# EAGLE design picoPromSD_1.1 (EAGLE 9.6.2)
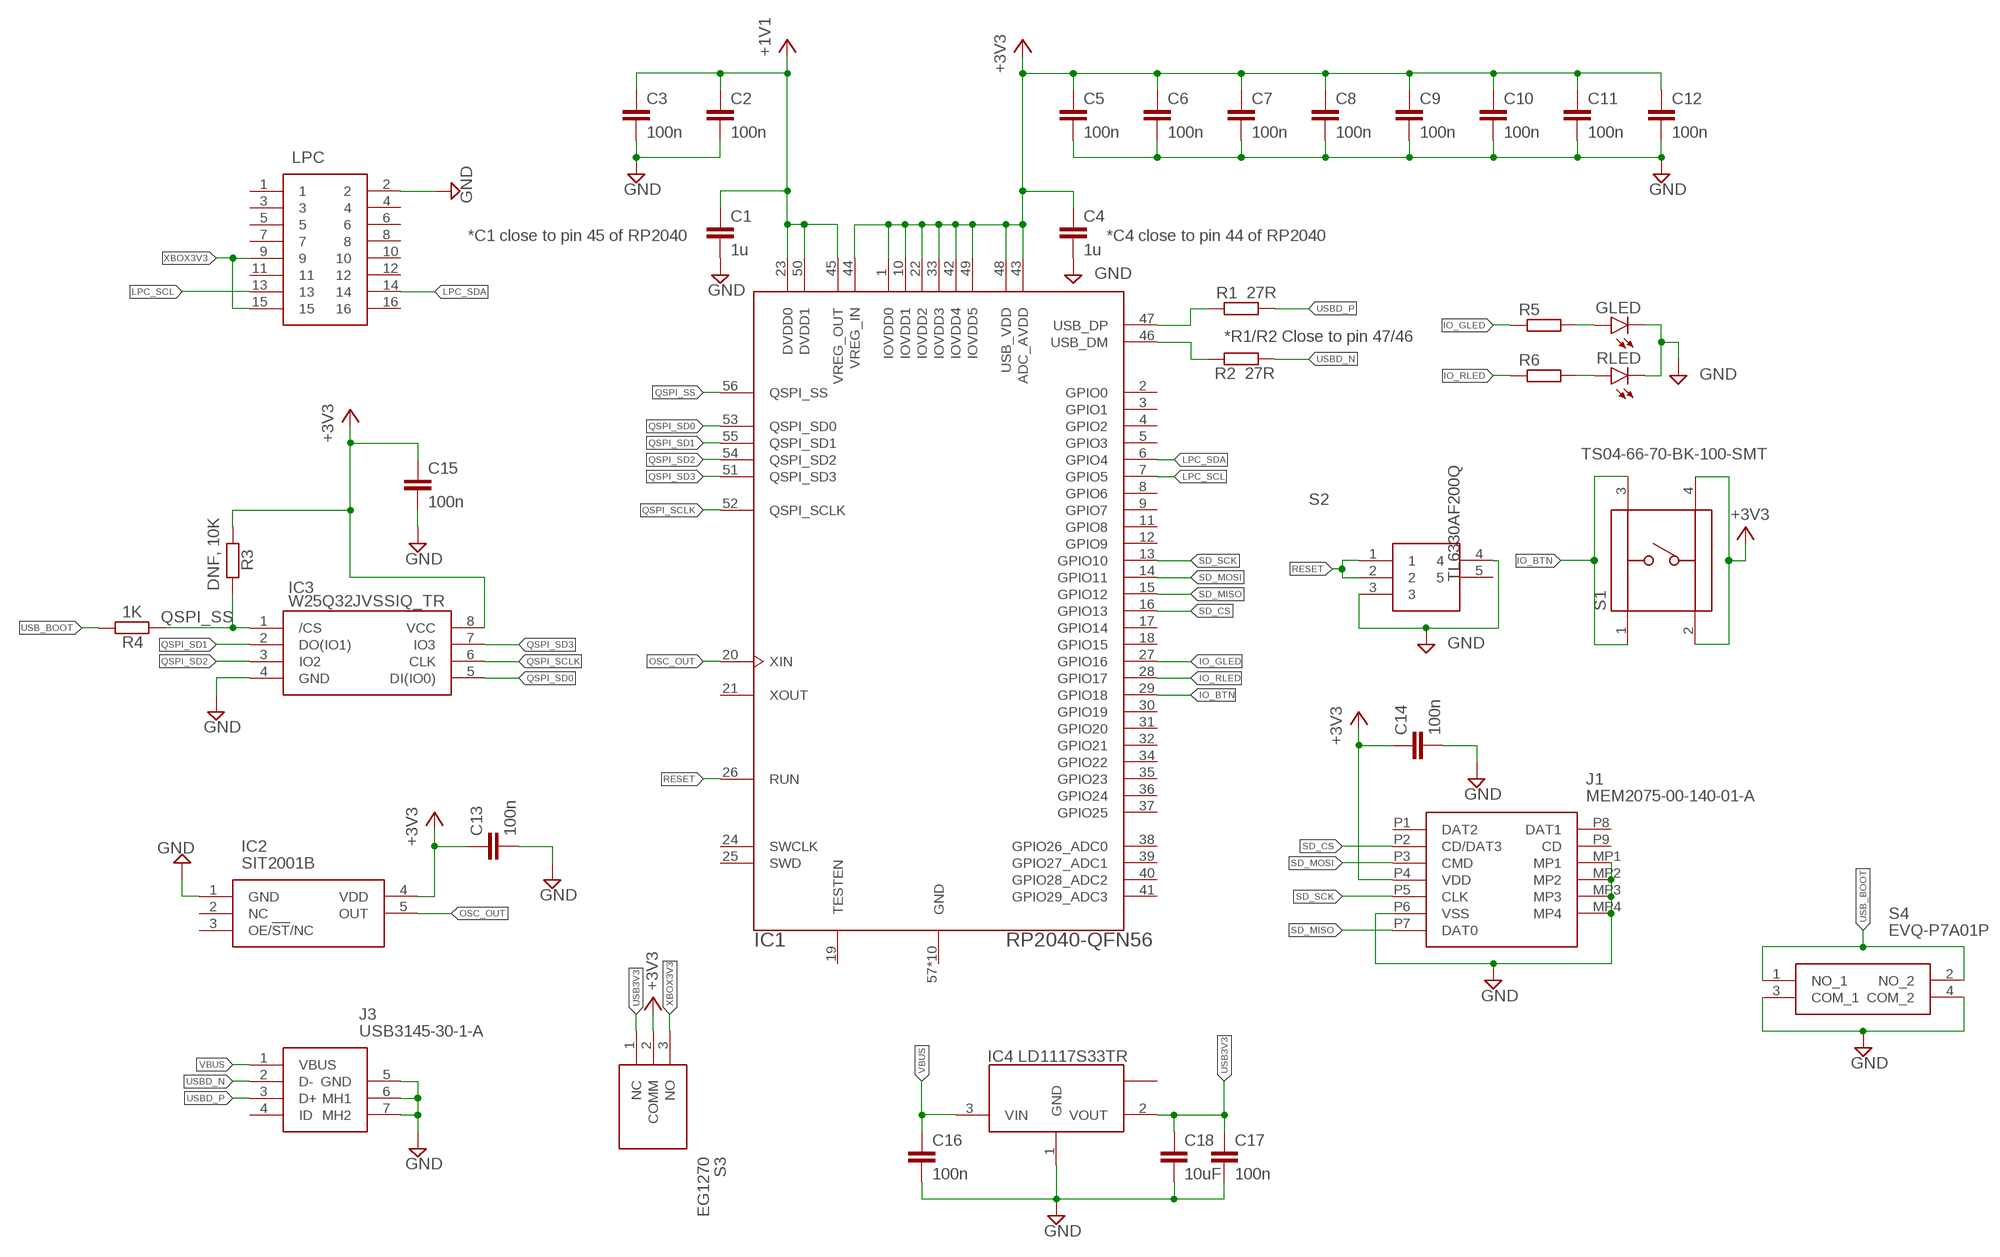
[diagram p0: schematic, sheet 1]

## Parts
C1  1u  C-EUC0402  [C0402]
C2  100n  C-EUC0402  [C0402]
C3  100n  C-EUC0402  [C0402]
C4  1u  C-EUC0402  [C0402]
C5  100n  C-EUC0402  [C0402]
C6  100n  C-EUC0402  [C0402]
C7  100n  C-EUC0402  [C0402]
C8  100n  C-EUC0402  [C0402]
C9  100n  C-EUC0402  [C0402]
C10  100n  C-EUC0402  [C0402]
C11  100n  C-EUC0402  [C0402]
C12  100n  C-EUC0402  [C0402]
C13  100n  C-EUC0402  [C0402]
C14  100n  C-EUC0402  [C0402]
C15  100n  C-EUC0402  [C0402]
C16  100n  C-EUC0402  [C0402]
C17  100n  C-EUC0402  [C0402]
C18  10uF  C-EUC0603  [C0603]
GLED  LED_LEDGREEN  [GHI-BASICCOMPONENTS_0805-LED]
IC1  RP2040-QFN56  [RP2040-QFN-56]
IC2  SIT2001B  [SOT95P280X130-5N]
IC3  W25Q32JVSSIQ_TR  [SOIC127P790X216-8N]
IC4  LD1117S33TR  [SOT223]
J1  MEM2075-00-140-01-A  [MEM20750014001A]
J3  USB3145-30-1-A  [USB3145301A]
LPC  61301621821  [RHDR16W79P254X254_2X8_2082X508]
R1  27R  R-EU_R0402  [R0402]
R2  27R  R-EU_R0402  [R0402]
R3  DNF, 10K  R-EU_R0402  [R0402]
R4  1K  R-EU_R0402  [R0402]
R5  R-EU_R0402  [R0402]
R6  R-EU_R0402  [R0402]
RLED  LED_LEDRED  [CHIP-LED0805]
S1  TS04-66-70-BK-100-SMT  [SW_TS04-66-70-BK-100-SMT]
S2  TL6330AF200Q  [TL6330AF200Q]
S3  EG1270  [EG1270]
S4  EVQ-P7A01P  [EVQP7J01P]

## Nets
+3V3 [Power]: C4.1 C5.1 C6.1 C7.1 C8.1 C9.1 C10.1 C11.1 C12.1 C13.1 C14.1 C15.1 IC1.1(IOVDD0) IC1.10(IOVDD1) IC1.22(IOVDD2) IC1.33(IOVDD3) IC1.42(IOVDD4) IC1.43(ADC_AVDD) IC1.44(VREG_IN) IC1.48(USB_VDD) IC1.49(IOVDD5) IC2.4(VDD) IC3.8(VCC) J1.P4(VDD) R3.2 S1.2 S1.4 S3.2(COMM)
GND: C1.2 C2.2 C3.2 C4.2 C5.2 C6.2 C7.2 C8.2 C9.2 C10.2 C11.2 C12.2 C13.2 C14.2 C15.2 C16.2 C17.2 C18.2 GLED.K(C) IC2.1(GND) IC3.4(GND) IC4.1(GND) J1.MP1 J1.MP2 J1.MP3 J1.MP4 J1.P6(VSS) J3.5(GND) J3.6(MH1) J3.7(MH2) LPC.2 RLED.C S2.3 S2.4 S4.3(COM_1) S4.4(COM_2)
IO_BTN: IC1.29(GPIO18) S1.1 S1.3
IO_GLED: IC1.27(GPIO16) R5.1
IO_RLED: IC1.28(GPIO17) R6.1
LPC_SCL: IC1.7(GPIO5) LPC.13
LPC_SDA: IC1.6(GPIO4) LPC.14
N$3: GLED.A R5.2
N$4: R6.2 RLED.A
OSC_OUT: IC1.20(XIN) IC2.5(OUT)
PUSBD_N [USB]: IC1.46(USB_DM) R2.1
PUSBD_P [USB]: IC1.47(USB_DP) R1.1
QSPI_SCLK: IC1.52(QSPI_SCLK) IC3.6(CLK)
QSPI_SD0: IC1.53(QSPI_SD0) IC3.5(DI(IO0))
QSPI_SD1: IC1.55(QSPI_SD1) IC3.2(DO(IO1))
QSPI_SD2: IC1.54(QSPI_SD2) IC3.3(IO2)
QSPI_SD3: IC1.51(QSPI_SD3) IC3.7(IO3)
QSPI_SS: IC1.56(QSPI_SS) IC3.1(/CS) R3.1 R4.2
RESET: IC1.26(RUN) S2.1 S2.2
SD_CS: IC1.16(GPIO13) J1.P2(CD/DAT3)
SD_MISO: IC1.15(GPIO12) J1.P7(DAT0)
SD_MOSI: IC1.14(GPIO11) J1.P3(CMD)
SD_SCK: IC1.13(GPIO10) J1.P5(CLK)
USB3V3 [Power]: C17.1 C18.1 IC4.2(VOUT) S3.1(NC)
USB_BOOT: R4.1 S4.1(NO_1) S4.2(NO_2)
USBD_N [USB]: J3.2(D-) R2.2
USBD_P [USB]: J3.3(D+) R1.2
VBUS [Power]: C16.1 IC4.3(VIN) J3.1(VBUS)
VCC: C1.1 C2.1 C3.1 IC1.23(DVDD0) IC1.45(VREG_OUT) IC1.50(DVDD1) ; supply symbol labelled +1V1
XBOX3V3 [Power]: LPC.9 LPC.15 S3.3(NO)
Unconnected: IC1.2(GPIO0) IC1.3(GPIO1) IC1.4(GPIO2) IC1.5(GPIO3) IC1.8(GPIO6) IC1.9(GPIO7) IC1.11(GPIO8) IC1.12(GPIO9) IC1.17(GPIO14) IC1.18(GPIO15) IC1.19(TESTEN) IC1.21(XOUT) IC1.24(SWCLK) IC1.25(SWD) IC1.30(GPIO19) IC1.31(GPIO20) IC1.32(GPIO21) IC1.34(GPIO22) IC1.35(GPIO23) IC1.36(GPIO24) IC1.37(GPIO25) IC1.38(GPIO26_ADC0) IC1.39(GPIO27_ADC1) IC1.40(GPIO28_ADC2) IC1.41(GPIO29_ADC3) IC2.2(NC) IC2.3(OE/!ST!/NC) IC4.4(HEATSINK) J1.P1(DAT2) J1.P8(DAT1) J1.P9(CD) J3.4(ID) LPC.1 LPC.3 LPC.4 LPC.5 LPC.6 LPC.7 LPC.8 LPC.10 LPC.11 LPC.12 LPC.16 S2.5

## Notes on the sheet
- *C1 close to pin 45 of RP2040 | *C4 close to pin 44 of RP2040
- *R1/R2 Close to pin 47/46

## Power pins joined to a net without a drawn wire
GND: IC1.57(GND) IC1.58(GND) IC1.59(GND) IC1.60(GND) IC1.61(GND) IC1.62(GND) IC1.63(GND) IC1.64(GND) IC1.65(GND) IC1.66(GND)

## Library data of the parts
C1-C18 = rcl:C-EU: CAPACITOR, European symbol; SPICEPREFIX: C
GLED RLED = SamacSys_Parts:LED_LED: LED OSRAM: - CHIPLED LG R971, LG N971, LY N971, LG Q971, LY Q971, LO R971, LY R971 LH N974, LH R974 LS Q976, LO Q976, LY Q976 LO Q996 - Hyper CHIPLED LW Q18S LB Q993, LB Q99A, LB R99A - SideLED LS A670, LO A670, LY A670, LG A670, LP A670 LB A673, LV A673, LT A673, LW A673 LH A674 LY A675 LS A676, LA A676, LO A676, LY A676, LW A676 LS A679, LY A679, LG A679 - Hyper Micro SIDELED® LS Y876, LA Y876, LO Y876, LY Y876 LT Y87S - SmartLED LW L88C, LW L88S LB L89C, LB L89S, LG L890 LS L89K, LO L89K, LY L89K LS L896, LA L896, LO L896, LY L896 - TOPLED LS T670, LO T670, LY T670, LG T670, LP T670 LSG T670, LSP T670, LSY T670, LOP T670, LYG T670 LG T671, LOG T671, LSG T671 LB T673, LV T673, LT T673, LW T673 LH T674 LS T676, LA T676, LO T676, LY T676, LB T676, LH T676, LSB T676, LW T676 LB T67C, LV T67C, LT T67C, LS T67K, LO T67K, LY T67K, LW E67C LS E67B, LA E67B, LO E67B, LY E67B, LB E67C, LV E67C, LT E67C LW T67C LS T679, LY T679, LG T679 LS T770, LO T770, LY T770, LG T770, LP T770 LB T773, LV T773, LT T773, LW T773 LH T774 LS E675, LA E675, LY E675, LS T675 LS T776, LA T776, LO T776, LY T776, LB T776 LHGB T686 LT T68C, LB T68C - Hyper Mini TOPLED® LB M676 - Mini TOPLED Santana® LG M470 LS M47K, LO M47K, LY M47K Source: http://www.osram.convergy.de LUXEON: - LUMILED® LXK2-PW12-R00, LXK2-PW12-S00, LXK2-PW14-U00, LXK2-PW14-V00 LXK2-PM12-R00, LXK2-PM12-S00, LXK2-PM14-U00 LXK2-PE12-Q00, LXK2-PE12-R00, LXK2-PE12-S00, LXK2-PE14-T00, LXK2-PE14-U00 LXK2-PB12-K00, LXK2-PB12-L00, LXK2-PB12-M00, LXK2-PB14-N00, LXK2-PB14-P00, LXK2-PB14-Q00 LXK2-PR12-L00, LXK2-PR12-M00, LXK2-PR14-Q00, LXK2-PR14-R00 LXK2-PD12-Q00, LXK2-PD12-R00, LXK2-PD12-S00 LXK2-PH12-R00, LXK2-PH12-S00 LXK2-PL12-P00, LXK2-PL12-Q00, LXK2-PL12-R00 Source: www.luxeon.com KINGBRIGHT: KA-3528ASYC Source: www.kingbright.com
IC1 = RpiPico:RP2040-QFN56
IC2 = SIT2001BI-S2-33E-12.000000G:SIT2001B: SITIME - SIT2001BI-S2-33E-12.000000G - CLOCK GENERATOR, 1-O/P, 12MHZ, SOT-23-5 Source: Datasheet <https://datasheet.datasheetarchive.com/originals/distributors/DKDS42/DSANUWW0050454.pdf>; DESCRIPTION: SITIME - SIT2001BI-S2-33E-12.000000G - CLOCK GENERATOR, 1-O/P, 12MHZ, SOT-23-5; HEIGHT: 1.3mm; MANUFACTURER_NAME: SiTime; MANUFACTURER_PART_NUMBER: SIT2001BI-S2-33E-12.000000G; MOUSER_PART_NUMBER: 788-2001BIS233E120G; MOUSER_PRICE-STOCK: https://www.mouser.co.uk/ProductDetail/SiTime/SiT2001BI-S2-33E-12000000G?qs=dMZC7um9hO8zW404%2Fztd2Q%3D%3D
IC3 = W25Q32JVSSIQ_TR:W25Q32JVSSIQ_TR: NOR Flash spiFlash, 32M-bit, DTR, 4Kb Uniform Sector Source: Datasheet <https://www.winbond.com/resource-files/w25q32jv spi revc 08302016.pdf>; DESCRIPTION: NOR Flash spiFlash, 32M-bit, DTR, 4Kb Uniform Sector; HEIGHT: 2.16mm; MANUFACTURER_NAME: Winbond; MANUFACTURER_PART_NUMBER: W25Q32JVSSIQ TR; MOUSER_PART_NUMBER: 454-W25Q32JVSSIQTR; MOUSER_PRICE-STOCK: https://www.mouser.co.uk/ProductDetail/Winbond/W25Q32JVSSIQ-TR?qs=qSfuJ%252Bfl%2Fd73AdQzQa%2FEuA%3D%3D
IC4 = SamacSys_Parts:LD1117S33TR: LDO Voltage Regulators 3.3V 0.8A Positive Source: Datasheet <https://datasheet.lcsc.com/szlcsc/STMicroelectronics-LD1117S33TR_C86781.pdf>
J1 = SamacSys_Parts:MEM2075-00-140-01-A: GCT (GLOBAL CONNECTOR TECHNOLOGY) - MEM2075-00-140-01-A - MICRO SD CARD CONN, PUSH-PUSH, 9POS, SMT Source: Datasheet; DESCRIPTION: GCT (GLOBAL CONNECTOR TECHNOLOGY) - MEM2075-00-140-01-A - MICRO SD CARD CONN, PUSH-PUSH, 9POS, SMT; HEIGHT: 1.45mm; MANUFACTURER_NAME: GCT (GLOBAL CONNECTOR TECHNOLOGY); MANUFACTURER_PART_NUMBER: MEM2075-00-140-01-A; MOUSER_PART_NUMBER: 640-MEM20750014001A; MOUSER_PRICE-STOCK: https://www.mouser.co.uk/ProductDetail/GCT/MEM2075-00-140-01-A?qs=KUoIvG%2F9IlZvfWpeERlq3Q%3D%3D
J3 = USB3145-30-1-A:USB3145-30-1-A: GCT (GLOBAL CONNECTOR TECHNOLOGY) - USB3145-30-1-A - MICRO USB, 2.0 TYPE B, RECEPTACLE, TH Source: Datasheet; DESCRIPTION: GCT (GLOBAL CONNECTOR TECHNOLOGY) - USB3145-30-1-A - MICRO USB, 2.0 TYPE B, RECEPTACLE, TH; HEIGHT: mm; MANUFACTURER_NAME: GCT (GLOBAL CONNECTOR TECHNOLOGY); MANUFACTURER_PART_NUMBER: USB3145-30-1-A; MOUSER_PART_NUMBER: 640-USB3145-30-1-A; MOUSER_PRICE-STOCK: https://www.mouser.co.uk/ProductDetail/GCT/USB3145-30-1-A?qs=KUoIvG%2F9IlYD1lvSRu5iyg%3D%3D
LPC = PPTC082LFBN-RC:61301621821: WURTH ELEKTRONIK - 61301621821 - CONNECTOR, RCPT, 16POS, 2ROW, 2.54MM Source: Datasheet <http://katalog.we-online.de/em/datasheet/6130xx21821.pdf>; DESCRIPTION: WURTH ELEKTRONIK - 61301621821 - CONNECTOR, RCPT, 16POS, 2ROW, 2.54MM; HEIGHT: 8.6mm; MANUFACTURER_NAME: Wurth Elektronik; MANUFACTURER_PART_NUMBER: 61301621821; MOUSER_PART_NUMBER: 710-61301621821; MOUSER_PRICE-STOCK: https://www.mouser.co.uk/ProductDetail/Wurth-Elektronik/61301621821?qs=GedFDFLaBXGpn7FxmOhVBw%3D%3D
R1-R6 = rcl:R-EU_: RESISTOR, European symbol; SPICEPREFIX: R
S1 = SamacSys_Parts:TS04-66-70-BK-100-SMT: Check availability <https://pricing.snapeda.com/parts/TS04-66-70-BK-100-SMT/CUI%20Devices/view-part?ref=eda>; AVAILABILITY: In Stock; CUI_PURCHASE_URL: https://www.cuidevices.com/product/switches/tactile-switches/ts04-series?utm_source=snapeda.com&utm_medium=referral&utm_campaign=snapedaBOM; DESCRIPTION: 6 x 6 mm, 4.3~9.5 mm Actuator Height, 100~260 gf, Surface Mount, SPST, Tactile Switch; MF: CUI Devices; MP: TS04-66-70-BK-100-SMT; PACKAGE: None; PRICE: None; PURCHASE-URL: https://pricing.snapeda.com/search/part/TS04-66-70-BK-100-SMT/?ref=eda
S2 = TL6330AF200Q:TL6330AF200Q: E-SWITCH - TL6330AF200Q - TACTILE SW, SPST, 1VA, 32VDC, SMD Source: Datasheet <https://datasheet.datasheetarchive.com/originals/distributors/DKDS-1/15071.pdf>; DESCRIPTION: E-SWITCH - TL6330AF200Q - TACTILE SW, SPST, 1VA, 32VDC, SMD; HEIGHT: 1mm; MANUFACTURER_NAME: E-Switch; MANUFACTURER_PART_NUMBER: TL6330AF200Q; MOUSER_PART_NUMBER: 612-TL6330AF200Q; MOUSER_PRICE-STOCK: https://www.mouser.co.uk/ProductDetail/E-Switch/TL6330AF200Q?qs=W0yvOO0ixfEUKtP%2FNRR8aw%3D%3D
S3 = EG1270:EG1270: E-SWITCH - EG1270 - SWITCH, SLIDE, SPDT, 300mA, 6V, PCB Source: Datasheet <https://componentsearchengine.com/Datasheets/1/EG1270.pdf>; DESCRIPTION: E-SWITCH - EG1270 - SWITCH, SLIDE, SPDT, 300mA, 6V, PCB; HEIGHT: 4.6mm; MANUFACTURER_NAME: E-Switch; MANUFACTURER_PART_NUMBER: EG1270; MOUSER_PART_NUMBER: 612-EG1270; MOUSER_PRICE-STOCK: https://www.mouser.co.uk/ProductDetail/E-Switch/EG1270?qs=xDsBkp9LkodMM2ilVTltow%3D%3D
S4 = EVQ-P7A01P:EVQ-P7A01P: Black Side Tactile Switch, Single Pole Single Throw (SPST) 50 mA @ 12 V dc 1.7mm Source: Datasheet <https://industrial.panasonic.com/cdbs/www-data/pdf/ATK0000/ATK0000C378.pdf>; DESCRIPTION: Black Side Tactile Switch, Single Pole Single Throw (SPST) 50 mA @ 12 V dc 1.7mm; HEIGHT: 1mm; MANUFACTURER_NAME: Panasonic; MANUFACTURER_PART_NUMBER: EVQ-P7A01P; MOUSER_PART_NUMBER: 667-EVQP7A01P; MOUSER_PRICE-STOCK: https://www.mouser.co.uk/ProductDetail/Panasonic/EVQ-P7A01P?qs=rJ%252BziJWpysz7n3C20u6WAw%3D%3D

## Net classes
1 USB: width 0.24 mm
2 Power: width 0.006 mm

## Board
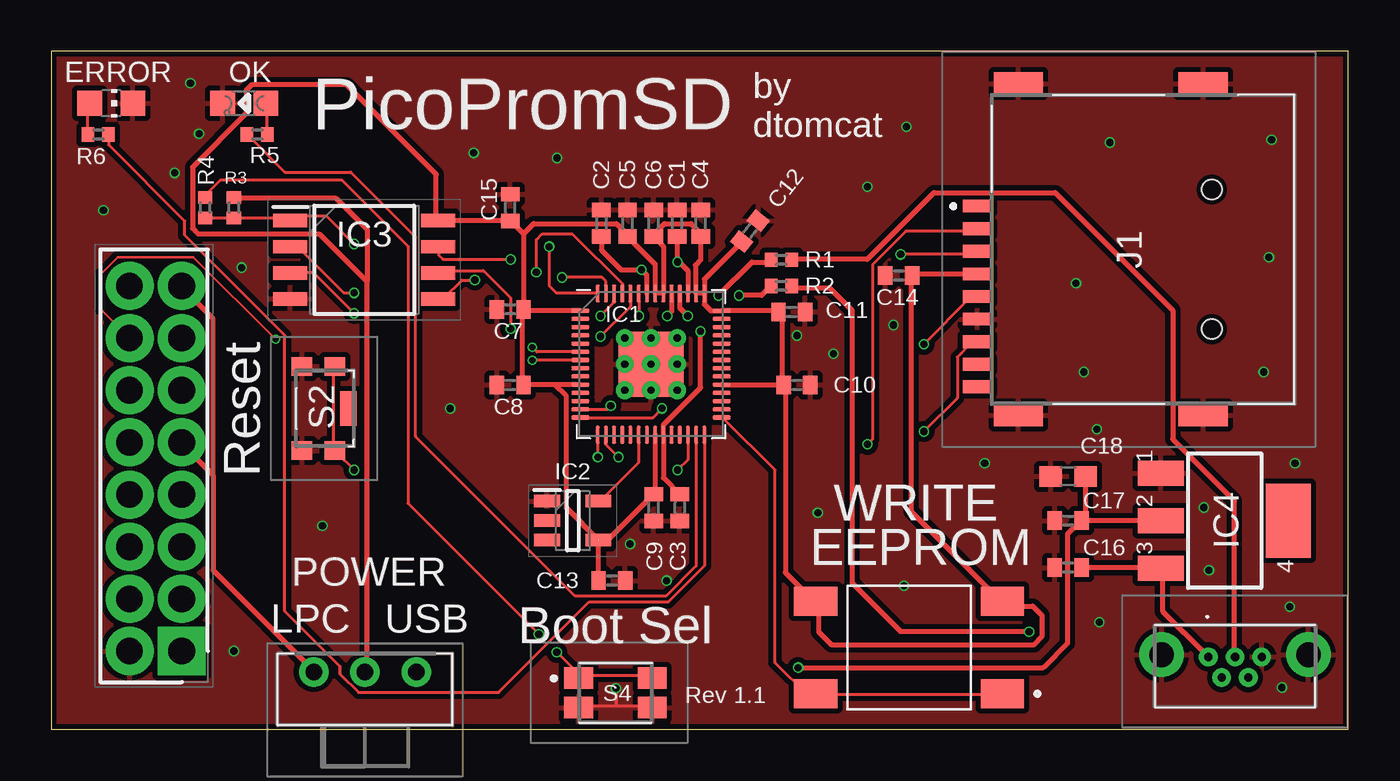
[diagram p1: board, top side]
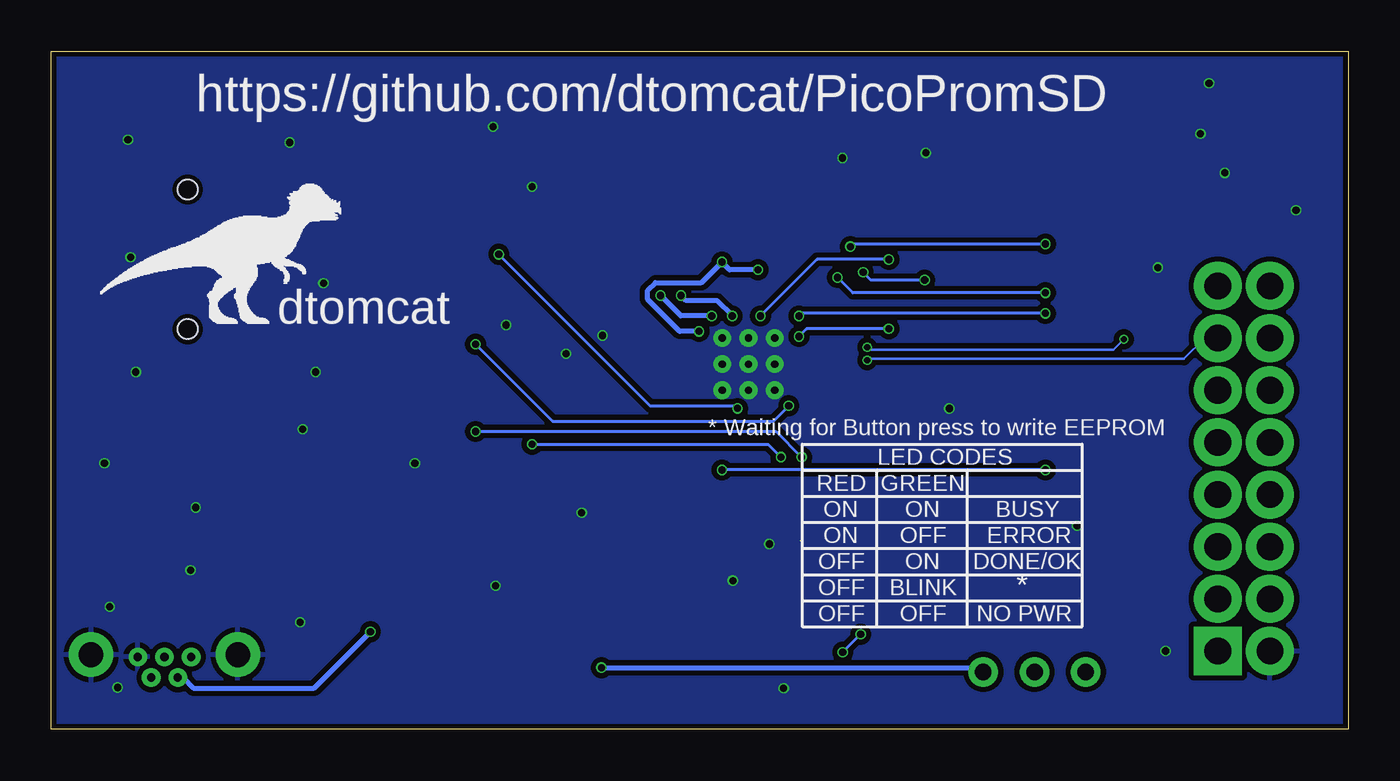
[diagram p2: board, bottom side, seen from below]

Size 63.17 x 33.01 mm. Coordinates in mm from the lower left corner, seen from the top.
Outline: 0,0 63.17,0 63.17,33.01 0,33.01 0,0
Copper layers (1*16): Top 0.035mm / dielectric 1.6mm / Bottom 0.035mm
Design rules "jlcpcb-2layers *": minimum track width 5mil, minimum drill 0.3mm, track to track 5mil, track to pad 5mil, pad to pad 5mil, via to via 5mil, smd to smd 5mil, copper to edge 0.2mm, drill to drill 6mil, minimum pad ring 10mil, minimum via ring 3mil, stop-mask expansion 4mil, vias tented up to drill 15mil, thermal gap 10mil

### Footprints (pad centres in the part's own frame; a part is rotated, then mirrored left to right if it is on the bottom)
C0402 = smd 0.7 x 0.9: 1 -0.65,0; 2 0.65,0
C0603 = smd 1.1 x 1: 1 -0.85,0; 2 0.85,0
GHI-BASICCOMPONENTS_0805-LED = smd 1.2 x 1.2: A 0,1.05; K 0,-1.05
RP2040-QFN-56 = smd 0.875 x 0.2: 1 -3.438,2.6; 2 -3.438,2.2; 3 -3.438,1.8; 4 -3.438,1.4; 5 -3.438,1; 6 -3.438,0.6; 7 -3.438,0.2; 8 -3.438,-0.2; 9 -3.438,-0.6; 10 -3.438,-1; 11 -3.438,-1.4; 12 -3.438,-1.8; 13 -3.438,-2.2; 14 -3.438,-2.6; 29 3.438,-2.6; 30 3.438,-2.2; 31 3.438,-1.8; 32 3.438,-1.4; 33 3.438,-1; 34 3.438,-0.6; 35 3.438,-0.2; 36 3.438,0.2; 37 3.438,0.6; 38 3.438,1; 39 3.438,1.4; 40 3.438,1.8; 41 3.438,2.2; 42 3.438,2.6 | smd 0.2 x 0.875: 15 -2.6,-3.438; 16 -2.2,-3.438; 17 -1.8,-3.438; 18 -1.4,-3.438; 19 -1,-3.438; 20 -0.6,-3.438; 21 -0.2,-3.438; 22 0.2,-3.438; 23 0.6,-3.438; 24 1,-3.438; 25 1.4,-3.438; 26 1.8,-3.438; 27 2.2,-3.438; 28 2.6,-3.438; 43 2.6,3.438; 44 2.2,3.438; 45 1.8,3.438; 46 1.4,3.438; 47 1,3.438; 48 0.6,3.438; 49 0.2,3.438; 50 -0.2,3.438; 51 -0.6,3.438; 52 -1,3.438; 53 -1.4,3.438; 54 -1.8,3.438; 55 -2.2,3.438; 56 -2.6,3.438 | smd 3.2 x 3.2: 57 0,0 | drill 0.35 pad 0.6: 58 -1.275,1.275; 59 0,1.275; 60 1.275,1.275; 61 -1.275,0; 62 0,0; 63 1.275,0; 64 -1.275,-1.275; 65 0,-1.275; 66 1.275,-1.275
SOT95P280X130-5N = smd 1.25 x 0.6: 1 -1.25,0.95; 2 -1.25,0; 3 -1.25,-0.95; 4 1.25,-0.95; 5 1.25,0.95
SOIC127P790X216-8N = smd 1.65 x 0.65: 1 -3.6,1.905; 2 -3.6,0.635; 3 -3.6,-0.635; 4 -3.6,-1.905; 5 3.6,-1.905; 6 3.6,-0.635; 7 3.6,0.635; 8 3.6,1.905
SOT223 = smd 1.219 x 2.235: 1 -2.311,-3.099; 2 0,-3.099; 3 2.311,-3.099 | smd 3.6 x 2.2: 4 0,3.099
MEM20750014001A = smd 1.1 x 2.4: MP1 -8.075,5.725; MP2 -8.075,-3.275; MP3 8.075,-3.275; MP4 8.075,5.725 | smd 0.62 x 1.4: P1 2.105,7.725; P2 1.005,7.725; P3 -0.095,7.725; P4 -1.195,7.725; P5 -2.295,7.725; P6 -3.395,7.725; P7 -4.495,7.725; P8 -5.595,7.725; P9 -6.695,7.725 | hole 0.95: -3.885,-3.695; 2.915,-3.695
USB3145301A = drill 0.4 pad 0.8: 1 -1.3,0.22; 2 -0.65,-0.78; 3 0,0.22; 4 0.65,-0.78; 5 1.3,0.22 | drill 1.202 pad 1.803: 6 -3.575,0.33; 7 3.575,0.33
RHDR16W79P254X254_2X8_2082X508 = drill 1.3 pad 1.95 square: 1 0,0 | drill 1.3 pad 1.95: 2 0,2.54; 3 2.54,0; 4 2.54,2.54; 5 5.08,0; 6 5.08,2.54; 7 7.62,0; 8 7.62,2.54; 9 10.16,0; 10 10.16,2.54; 11 12.7,0; 12 12.7,2.54; 13 15.24,0; 14 15.24,2.54; 15 17.78,0; 16 17.78,2.54
R0402 = smd 0.6 x 0.7: 1 -0.5,0; 2 0.5,0
CHIP-LED0805 = smd 1.2 x 1.2: A 0,-1.05; C 0,1.05
SW_TS04-66-70-BK-100-SMT = smd 2.1 x 1.4: 1 -4.55,2.25; 2 -4.55,-2.25; 3 4.55,2.25; 4 4.55,-2.25
TL6330AF200Q = smd 0.9 x 1: 1 -2.05,-0.475; 2 2.05,-0.475; 3 2.05,1.125; 4 -2.05,1.125 | smd 1.7 x 0.8: 5 0,-1.125
EG1270 = drill 0.8 pad 1.3: 1 0,0; 2 0,2.5; 3 0,5
EVQP7J01P = smd 1.4 x 1.05: 1 -1.5,0.725; 2 2.1,0.725; 3 -1.5,-0.725; 4 2.1,-0.725

### Placement (x,y rotation side)
C1  30.48,24.64 90 top
C2  26.8,24.64 90 top
C3  30.61,10.79 270 top
C4  31.62,24.64 90 top
C5  28.07,24.64 90 top
C6  29.34,24.64 90 top
C7  22.35,20.45 180 top
C8  22.35,16.76 180 top
C9  29.34,10.79 270 top
C10  36.32,16.76 0 top
C11  36.07,20.32 0 top
C12  34.04,24.26 51.8 top
C13  27.3,7.24 0 top
C14  41.27,22.1 180 top
C15  22.35,25.4 90 top
C16  49.53,7.87 180 top
C17  49.53,10.16 180 top
C18  49.53,12.32 180 top
GLED  9.4,30.48 270 top
IC1  29.21,17.78 0 top
IC2  25.4,10.16 0 top
IC3  15.24,22.86 0 top
IC4  57.15,10.16 270 top
J1  52.83,23.37 90 top
J3  57.66,3.3 0 top
LPC  6.35,3.81 90 top
R1  35.56,22.86 0 top
R2  35.56,21.59 0 top
R3  8.89,25.4 90 top
R4  7.49,25.4 270 top
R5  10.03,28.96 0 top
R6  2.29,28.96 180 top
RLED  2.92,30.48 270 top
S1  41.78,3.98 180 top
S2  13.34,15.62 90 top
S3  17.78,2.79 90 top
S4  27.18,1.78 0 top

### Tracks (layer width: path | path; a pad name or v marks a point on that pad's centre or on a via)
+3V3  (1 unrouted)
  Top 0.152: 31.37,21.26 IC1.44 31.5,21.25 | 32.66,16.76 IC1.33 | 35.36,20.38 C11.1 35.5,20.25 35.62,20.12 | 25.76,16.76 IC1.10 | IC2.4 27.1,9.21 | 42,22.17 C14.1 41.88,22 | 9,25.88 R3.2 | 15.38,2.88 S3.2 | 46.07,6.43 S1.2 46.49,6 | 23,16.88 C8.1 | 23,20.38 23,20.4 C7.1 23,20.5 | 22.38,24.75 C15.1 | 29.75,21.25 IC1.48 | 29.5,21.25 IC1.49 | 32.62,20.38 IC1.42 | 31.75,21.25 IC1.43 | 35.62,16.88 C10.1 35.75,16.75 | C6.1 29.38,24 29.38,24.12 | C4.1 31.5,24 31.5,24.29 | 37.02,6.36 S1.4 37.38,5.66 | C5.1 28,24 28,24.15 | 18.75,24.88 IC3.8
  Top 0.24: C4.1 31.62,22.86 31.37,22.61 31.37,21.26 | C6.1 29.81,23.52 IC1.48 | C5.1 29.41,22.64 IC1.49 | C12.1 31.81,21.92 IC1.43 31.81,20.69 32.13,20.38 32.62,20.38 | 35.36,20.38 IC1.42 | C13.1 IC2.4 | 42,22.17 J1.P4 | C15.1 IC3.8 | 9,25.88 13.85,25.88 15.38,24.35 15.38,21.8 | 46.07,6.43 41.88,10.62 41.88,22 | 23,24.12 23,20.5 | 22.38,24.75 23,24.12 | 26.68,9.18 25.09,10.78 25.09,16.22 24.52,16.78 | 29.5,21.25 29.75,21.25 | 31.5,21.25 31.75,21.25 | 35.62,16.88 35.62,20.12 | 37.02,6.36 35.75,7.62 35.75,16.75 | 23,24.12 23.5,24.62 27.52,24.62 28,24.15 | 46.49,6 47.8,6 48.25,5.55 48.25,4.5 47.88,4.12 37.99,4.12 37.38,4.74 37.38,5.66 | 18.75,24.88 18.75,27.01 14.39,31.38 9.75,31.38 9.5,31.12 9.5,30 6.88,27.38 6.88,24.39 7.14,24.12 13.05,24.12 15.38,21.8 | 31.5,24.29 31.16,24.62 29.88,24.62 29.38,24.12 | 27.1,9.21 C9.1 29.41,11.52 IC1.22 | C8.1 22.99,16.78 | IC1.1 23,20.38 22.96,20.33 22.96,16.81 22.99,16.78 | IC1.33 35.66,16.78 C10.1 | IC1.10 24.52,16.78 | 24.52,16.78 22.99,16.78 | 15.38,2.88 15.38,21.8
GND  (via drill 0.35)
  Top 0.152: 27.5,1.12 29.25,1.12 S4.4 | 27.5,1.12 25.75,1.12 S4.3 | v27.5,2 27.5,1.12
  other vias: 19.43,15.62 13.21,9.91 37.34,10.54 2.54,25.27 6.01,27.09 7.2,29 6.77,31.45 20.57,28.07 24.64,27.81 39.75,26.42 41.66,29.34 51.56,28.57 49.91,21.72 50.29,17.4 50.93,14.61 45.47,12.95 51.05,5.21 41.53,6.99 38.1,18.29 36.32,19.18 8.89,3.81 9.27,22.48 28.19,9.02 29.97,7.24 60.33,5.97 60.58,12.95 59.05,17.4 59.31,22.99 59.44,28.7 56.13,10.79 56.39,7.75 59.94,2.03 41.02,19.68
  pour Top (isolate 0.254): -1.27,34.29 -1.27,-1.27 64.77,-1.27 64.77,33.02 63.5,34.29
  pour Bottom (isolate 0.254): -1.27,34.29 -1.27,-1.27 63.5,-1.27 63.5,34.29
IO_BTN
  Top 0.152: IC1.29 32.75,15.12 35.25,12.62 35.25,3.25 36.88,1.62 37.06,1.62 S1.3 38.17,1.73 38.19,1.71 46.31,1.71 S1.1
IO_GLED
  Top 0.152: R5.1 9.62,28.88 11.38,27.12 14.59,27.12 17.75,23.96 17.75,14.25 25.52,6.48 29.94,6.48 31.41,7.95 IC1.27
IO_RLED
  Top 0.152: R6.1 2.79,28.46 6.5,24.74 6.5,24.05 11.38,19.18 11.38,5.75 14.08,3.05 14.08,2.67 14.96,1.79 21.79,1.79 26.2,6.2 30.05,6.2 31.81,7.96 IC1.28
LPC_SCL  (via drill 0.3)
  Top 0.152: IC1.7 v23.44,17.98 v23.43,17.97
  Bottom 0.127: v23.43,17.97 23.37,18.03 8,18.03 6.99,19.05 LPC.13
LPC_SDA  (via drill 0.3)
  Top 0.127: v10.92,18.99 6.92,22.99 3.24,22.99 2.41,22.16 2.41,20.45 LPC.14
  Top 0.152: IC1.6 23.66,18.38 v23.43,18.61
  Bottom 0.127: v23.43,18.61 23.3,18.48 11.43,18.48 v10.92,18.99
N$3
  Top 0.152: R5.2 10.5,29 10.5,30.38 GLED.A
N$4
  Top 0.152: R6.2 1.75,29 1.75,30.38 RLED.A
OSC_OUT
  Top 0.152: IC1.20 28.62,14.25 28.62,13 26.75,11.12 IC2.5
PUSBD_N  (via drill 0.35)
  Top 0.24: 35,21.5 R2.1 34.59,21.12 v33.5,21.12 | IC1.46 30.61,20.52 v31,20.12
  Bottom 0.24: v33.5,21.12 32.5,20.12 v31,20.12
PUSBD_P  (via drill 0.35)
  Top 0.24: R1.1 35,22.75 34.12,22.75 v32.5,21.12 | IC1.47 30.21,20.34 v30,20.12
  Bottom 0.24: v32.5,21.12 32.25,20.88 30.75,20.88 v30,20.12
QSPI_SCLK  (via drill 0.35)
  Top 0.152: IC1.52 28.21,20.58 v26.75,19.12 | v22.38,19.5 22.38,21 21.04,22.33 18.88,22.33 18.88,22.25 IC3.6
  Bottom 0.152: v26.75,19.12 26.38,19.5 v22.38,19.5
QSPI_SD0  (via drill 0.35)
  Top 0.152: IC1.53 27.82,21.68 25.38,24.12 23.91,24.12 23.62,23.84 v23.62,22.25 | v20.62,21.88 20,21.88 19.12,21 18.88,21 IC3.5
  Bottom 0.152: v23.62,22.25 23.25,21.88 v20.62,21.88
QSPI_SD1  (via drill 0.35)
  Top 0.152: v14.75,21.25 14.25,21.25 12.12,23.38 11.75,23.38 IC3.2 | 27,21.25 IC1.55 27.01,21.8 27.01,21.81 26.82,22 v24.88,22
  Bottom 0.152: v24.88,22 24.12,21.25 v14.75,21.25
QSPI_SD2  (via drill 0.35)
  Top 0.152: IC1.54 27.42,20.79 v26.75,20.12 | v14.75,20.25 12.75,22.25 11.75,22.25 IC3.3
  Bottom 0.152: v26.75,20.12 26.62,20.25 v14.75,20.25
QSPI_SD3  (via drill 0.35)
  Top 0.152: 28.62,21.12 IC1.51 28.62,21.2 v28.62,20.12 | IC3.7 18.88,23.38 18.88,23.08 19.08,22.88 v22.38,22.88
  Bottom 0.152: v28.62,20.12 25.88,22.88 v22.38,22.88
QSPI_SS  (via drill 0.35)
  Top 0.152: R4.2 7.5,24.88 8.88,24.88 R3.1 9,24.88 11.62,24.88 IC3.1 11.75,24.88 11.75,25 13.38,25 v14.75,23.62 | v24.25,23.5 24.25,21.59 24.59,21.25 26.62,21.25 IC1.56
  Bottom 0.152: v24.25,23.5 24.12,23.62 v14.75,23.62
RESET  (via drill 0.35)
  Top 0.152: v14.75,12.62 13.88,13.5 S2.1 13.75,13.62 13.75,17.62 S2.2 | 31,14.25 IC1.26 31.01,13.13 v30.5,12.62
  Bottom 0.152: v14.75,12.62 v30.5,12.62
SD_CS  (via drill 0.35)
  Top 0.152: v27.62,13.25 27,13.88 27,14.25 IC1.16 | v39.75,13.88 40,14.12 40,22.62 41.62,24.25 45,24.25 J1.P2
  Bottom 0.152: v27.62,13.25 28.25,13.88 v39.75,13.88
SD_MISO  (via drill 0.35)
  Top 0.152: v26.62,13.25 26.62,14.25 IC1.15 | v42.5,14.5 44.12,16.12 44.12,18.12 44.75,18.75 45,18.75 J1.P7
  Bottom 0.152: v26.62,13.25 27.88,14.5 v42.5,14.5
SD_MOSI  (via drill 0.35)
  Top 0.152: v41.38,23.12 45,23.12 45,23.25 J1.P3 | 25.8,15.17 IC1.14 29.3,15.18 v29.75,15.62
  Bottom 0.152: v29.75,15.62 29.88,15.75 34,15.75 v41.38,23.12
SD_SCK  (via drill 0.35)
  Top 0.152: v42.5,18.75 44.75,21 45,21 J1.P5 | IC1.13 27.08,15.58 v27.25,15.75
  Bottom 0.152: v27.25,15.75 28,15 38.75,15 v42.5,18.75
USB3V3  (via drill 0.35)
  Top 0.152: C17.1 50.25,10.25 50.38,10.38 C17.1 | 50.38,12.25 C18.1 | 54,10.38 54,10.25 IC4.2 | 50.12,10.12 C17.1
  Top 0.24: 50.38,12.25 50.38,10.38 | v36.38,3 48.31,3 49.5,4.19 49.5,9.5 50.12,10.12 | IC4.2 C17.1
  Bottom 0.24: v36.38,3 18,3 17.88,2.88 S3.1
USB_BOOT  (via drill 0.35)
  Top 0.152: v23.75,4.62 17.38,11 17.38,23.52 14.14,26.75 8.25,26.75 7.5,26 R4.1 | v24.62,3.75 25.62,2.75 25.62,2.62 S4.1 25.75,2.62 29.25,2.62 S4.2
  Bottom 0.152: v24.62,3.75 v23.75,4.62
USBD_N  (via drill 0.35)
  Top 0.24: v47.62,4.75 41.38,4.75 39,7.12 39,20.4 37.9,21.5 36.12,21.5 R2.2
  Bottom 0.24: v47.62,4.75 50.38,2 56.25,2 56.75,2.5 57,2.5 J3.2
USBD_P
  Top 0.24: R1.2 36.12,22.88 39.75,22.88 43,26.12 48.91,26.12 54.62,20.41 54.62,14.12 57.62,11.12 57.62,3.62 J3.3
VBUS
  Top 0.152: 50.25,7.88 C16.1 | 54,7.88 IC4.3 54.12,7.75
  Top 0.24: 54,7.88 50.25,7.88 | 54.12,7.75 54.12,5.75 56.25,3.62 J3.1
VCC  (via drill 0.35)
  Top 0.152: 30.48,22.86 30.55,22.8 v30.5,22.75 | 29.83,14.35 IC1.23
  Top 0.24: C1.1 30.48,22.86 | IC1.45 31.01,22.33 30.55,22.8 | IC1.50 29.01,22.11 v28.75,22.38 27.76,22.38 26.8,23.34 C2.1 | v31.62,19.38 v31.63,19.37 31.63,16.64 29.81,14.82 IC1.23 29.81,12.24 C3.1
  Bottom 0.24: v28.75,22.38 30.12,22.38 v30.5,22.75 31.5,21.75 33.75,21.75 34.12,21.38 34.12,20.94 32.56,19.38 v31.62,19.38
XBOX3V3
  Top 0.152: 12.75,2.88 S3.3 | 6.38,13.88 LPC.9
  Top 0.24: 12.75,2.88 7.88,7.75 7.88,12.37 | 6.38,13.88 7.88,12.37 | 7.88,12.37 7.88,20 6.38,21.5 LPC.15

### Text on the board
tPlace: ERROR | OK | PicoPromSD | by / dtomcat | Reset | WRITE | EEPROM | POWER | LPC USB | Boot Sel | Rev 1.1
bPlace: https://github.com/dtomcat/PicoPromSD | dtomcat | * Waiting for Button press to write EEPROM | LED CODES | GREEN | RED | BUSY | ON | ON | ERROR | OFF | ON | DONE/OK | ON | OFF | * | BLINK | OFF | NO PWR | OFF | OFF